# EAGLE schematic circuitPendulumController01 (EAGLE 6.6.0)
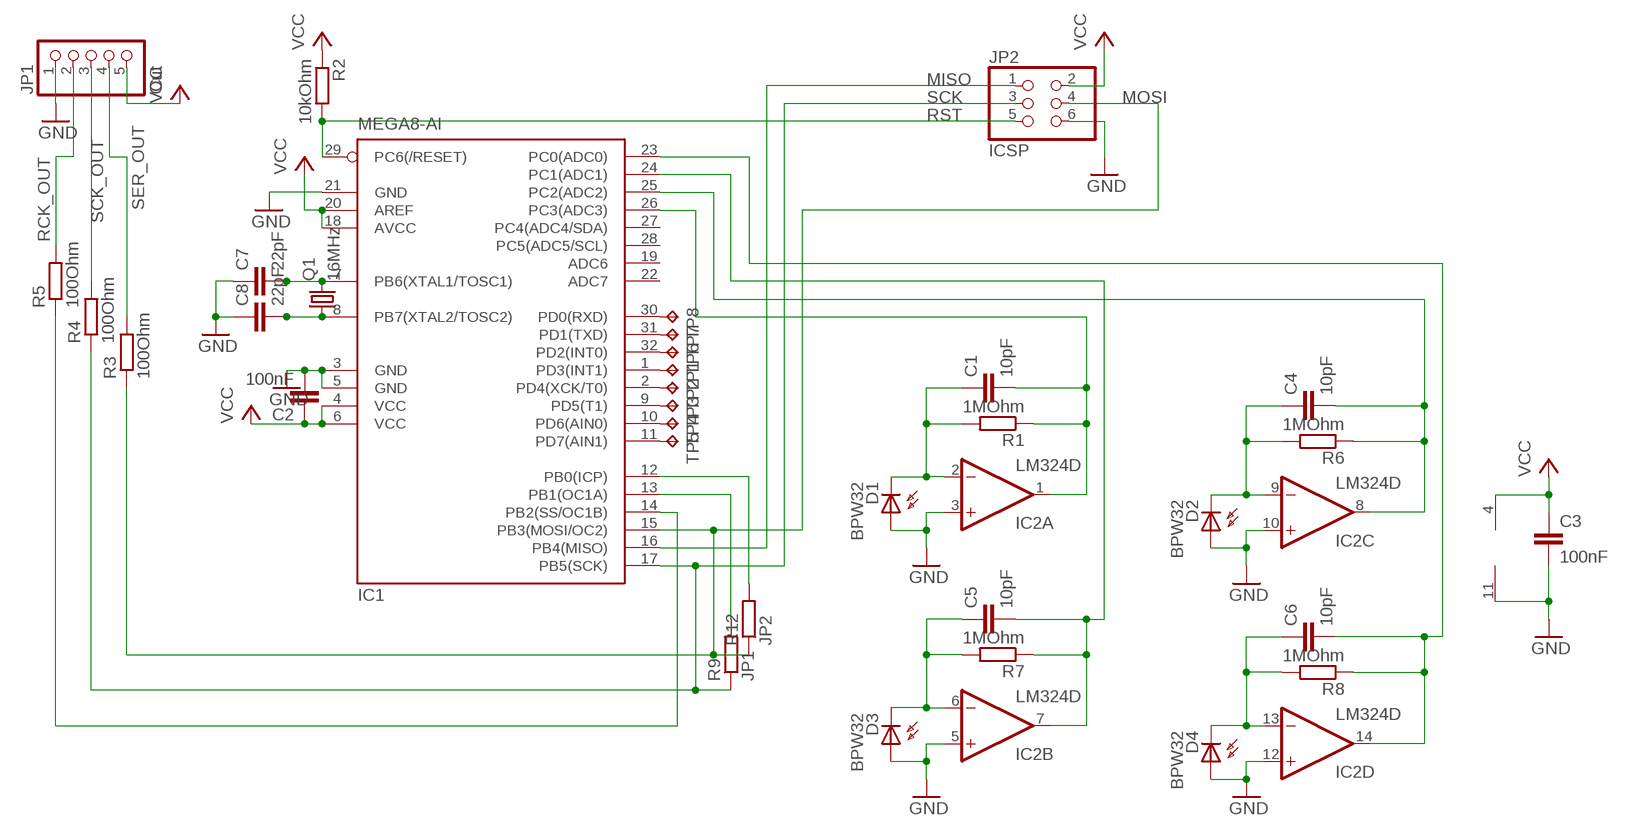
[diagram p0: schematic, sheet 1]

## Parts
C1  10pF  C-EUC0603  [C0603]
C2  100nF  C-EUC0603  [C0603]
C3  100nF  C-EUC0603  [C0603]
C4  10pF  C-EUC0603  [C0603]
C5  10pF  C-EUC0603  [C0603]
C6  10pF  C-EUC0603  [C0603]
C7  22pF  C-EUC0603  [C0603]
C8  22pF  C-EUC0603  [C0603]
D1  BPW32  [BPW32]
D2  BPW32  [BPW32]
D3  BPW32  [BPW32]
D4  BPW32  [BPW32]
IC1  MEGA8-AI  [TQFP32-08]
IC2  LM324D  [SO14]
JP1  Out  PINHD-1X55X2MM  [1_05X2MM]
JP2  ICSP  PINHD-2X3  [2X03]
Q1  16MHz  CRYSTALHC49S  [HC49/S]
R1  1MOhm  R-EU_R0603  [R0603]
R2  10kOhm  R-EU_R0603  [R0603]
R3  100Ohm  R-EU_R0603  [R0603]
R4  100Ohm  R-EU_R0603  [R0603]
R5  100Ohm  R-EU_R0603  [R0603]
R6  1MOhm  R-EU_R0603  [R0603]
R7  1MOhm  R-EU_R0603  [R0603]
R8  1MOhm  R-EU_R0603  [R0603]
R9  JP1  R-EU_R0402  [R0402]
R12  JP2  R-EU_R0402  [R0402]
TP1  TPTP11R  [TP11R]
TP2  TPTP11R  [TP11R]
TP3  TPTP11R  [TP11R]
TP4  TPTP11R  [TP11R]
TP5  TPTP11R  [TP11R]
TP6  TPTP11R  [TP11R]
TP7  TPTP11R  [TP11R]
TP8  TPTP11R  [TP11R]

## Nets
GND: C2.2 C3.2 C7.1 C8.1 D1.A D2.A D3.A D4.A IC1.3(GND) IC1.5(GND) IC1.21(GND) IC2.3(A:+IN) IC2.5(B:+IN) IC2.10(C:+IN) IC2.11(P:V-) IC2.12(D:+IN) JP1.1 JP2.6
MISO: IC1.16(PB4(MISO)) JP2.1
MOSI: IC1.15(PB3(MOSI/OC2)) JP2.4 R3.1 R12.1
N$3: IC1.12(PB0(ICP)) R12.2
N$4: IC1.13(PB1(OC1A)) R9.2
N$6: IC1.14(PB2(SS/OC1B)) R5.1
N$7: C4.2 IC1.25(PC2(ADC2)) IC2.8(C:OUT) R6.1
N$8: C1.1 D1.K(C) IC2.2(A:-IN) R1.2
N$9: C5.1 D3.K(C) IC2.6(B:-IN) R7.2
N$10: C5.2 IC1.24(PC1(ADC1)) IC2.7(B:OUT) R7.1
N$11: C1.2 IC1.26(PC3(ADC3)) IC2.1(A:OUT) R1.1
N$12: C6.2 IC1.23(PC0(ADC0)) IC2.14(D:OUT) R8.1
N$13: C6.1 D4.K(C) IC2.13(D:-IN) R8.2
N$14: C4.1 D2.K(C) IC2.9(C:-IN) R6.2
N$15: C7.2 IC1.7(PB6(XTAL1/TOSC1)) Q1.2
N$16: C8.2 IC1.8(PB7(XTAL2/TOSC2)) Q1.1
N$17: IC1.1(PD3(INT1)) TP1.TP
N$18: IC1.2(PD4(XCK/T0)) TP2.TP
N$19: IC1.9(PD5(T1)) TP3.TP
N$20: IC1.10(PD6(AIN0)) TP4.TP
N$21: IC1.11(PD7(AIN1)) TP5.TP
N$22: IC1.32(PD2(INT0)) TP6.TP
N$23: IC1.31(PD1(TXD)) TP7.TP
N$24: IC1.30(PD0(RXD)) TP8.TP
RCK_OUT: JP1.2 R5.2
RST: IC1.29(PC6(/RESET)) JP2.5 R2.2
SCK: IC1.17(PB5(SCK)) JP2.3 R4.1 R9.1
SCK_OUT: JP1.3 R4.2
SER_OUT: JP1.4 R3.2
VCC: C2.1 C3.1 IC1.4(VCC) IC1.6(VCC) IC1.18(AVCC) IC1.20(AREF) IC2.4(P:V+) JP1.5 JP2.2 R2.1
Unconnected: IC1.19(ADC6) IC1.22(ADC7) IC1.27(PC4(ADC4/SDA)) IC1.28(PC5(ADC5/SCL))

## Library data of the parts
C1-C8 = resistor:C-EU: CAPACITOR, European symbol
D1-D4 = opto-trans-siemens:BPW32: PHOTO DIODE; OC_FARNELL: unknown; OC_NEWARK: unknown
IC1 = atmel:MEGA8: MICROCONTROLLER 8 Kbytes FLASH, 1 kbytes SRAM, 512 bytes EEPROM, USART, 6-channel 10 bit ADC, 2-channel 8 bit ADC Pin compatible with Atmega48, ATMega88, ATMega168 Source: avr.lbr; MPN: ATMEGA8-16AU; OC_FARNELL: 9171371; OC_NEWARK: 73M8863
IC2 = linear:LM324: OP AMP
JP1 = pinhead:PINHD-1X5: PIN HEADER
JP2 = pinhead:PINHD-2X3: PIN HEADER
Q1 = crystal:CRYSTAL: CRYSTAL; OC_FARNELL: 1667008; OC_NEWARK: unknown
R1-R9 R12 = resistor:R-EU_: RESISTOR, European symbol
TP1-TP8 = testpad:TP: Test pad